# EAGLE design RGB-strip-connector-v2 (EAGLE 7.2.0)
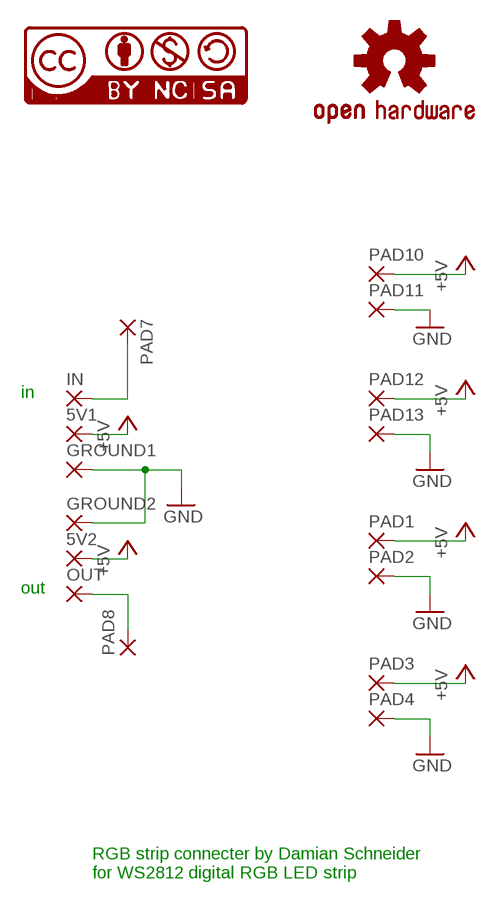
[diagram p0: schematic, sheet 1]

## Parts
5V1  SMD2  [SMD1,27-2,54]
5V2  SMD2  [SMD1,27-2,54]
GROUND1  SMD2  [SMD1,27-2,54]
GROUND2  SMD2  [SMD1,27-2,54]
IN  SMD2  [SMD1,27-2,54]
LOGO1  OSHW-LOGOL  [OSHW-LOGO-L]
OUT  SMD2  [SMD1,27-2,54]
PAD1  SMD5  [SMD2,54-5,08]
PAD2  SMD5  [SMD2,54-5,08]
PAD3  SMD5  [SMD2,54-5,08]
PAD4  SMD5  [SMD2,54-5,08]
PAD7  SMD2  [SMD1,27-2,54]
PAD8  SMD2  [SMD1,27-2,54]
PAD10  SMD5  [SMD2,54-5,08]
PAD11  SMD5  [SMD2,54-5,08]
PAD12  SMD5  [SMD2,54-5,08]
PAD13  SMD5  [SMD2,54-5,08]
U$1  CC-NC-BCNIX  [CC-NC-B_NIX]

## Nets
+5V: 5V1.1(P) 5V2.1(P) PAD1.1(P) PAD3.1(P) PAD10.1(P) PAD12.1(P)
GND: GROUND1.1(P) GROUND2.1(P) PAD2.1(P) PAD4.1(P) PAD11.1(P) PAD13.1(P)
N$1: OUT.1(P) PAD8.1(P)
N$2: IN.1(P) PAD7.1(P)

## Notes on the sheet
- in
- out
- RGB strip connecter by Damian Schneider
  for WS2812 digital RGB LED strip

## Library data of the parts
5V1 5V2 GROUND1 GROUND2 IN OUT PAD7 PAD8 = wirepad:SMD2: SMD PAD
LOGO1 = SparkFun-Aesthetics:OSHW-LOGO: Open Source Hardware Logo This logo indicates the piece of hardware it is found on incorporates a OSHW license and/or adheres to the definition of open source hardware found here: http://freedomdefined.org/OSHW
PAD1-PAD4 PAD10-PAD13 = wirepad:SMD5: SMD PAD
U$1 = cc-by-nc-sa:CC-NC-BC: All hardware is licensed under the Creative Commons Attribution-Noncommercial-Share Alike 2.5 Switzerland License. To view a copy of this license, visit http://creativecommons.org/licenses/by-nc-sa/2.5/ch/ or send a letter to Creative Commons, 171 Second Street, Suite 300, San Francisco, California, 94105, USA.

## Board
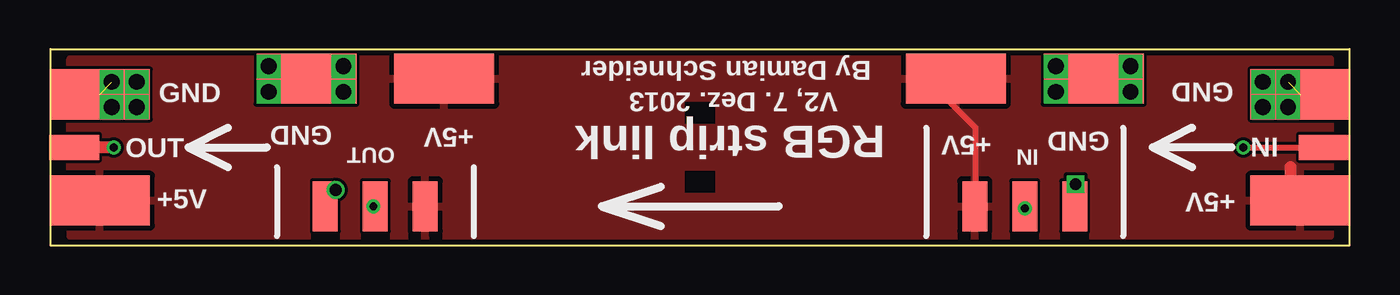
[diagram p1: board, top side]
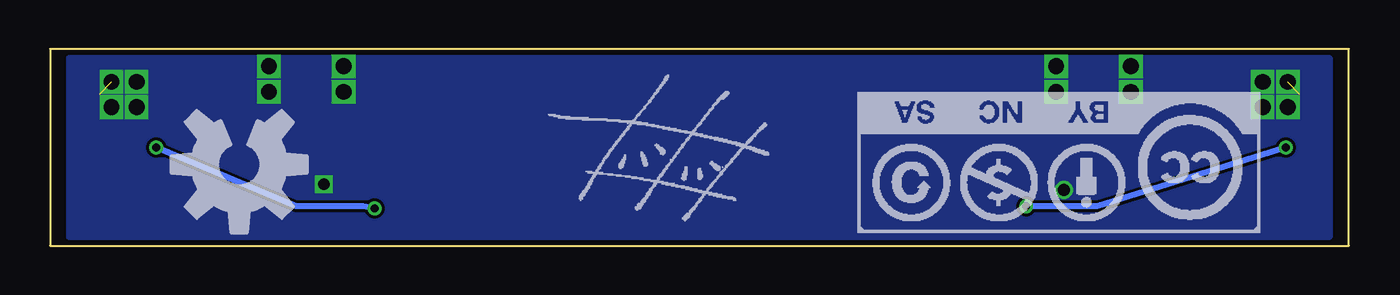
[diagram p2: board, bottom side, seen from below]

Size 66 x 10 mm. Coordinates in mm from the lower left corner, seen from the top.
Outline: 0,10 66,10 66,0 0,0 0,10
Copper layers (1*16): Top 0.035mm / dielectric 1.5mm / Bottom 0.035mm
Design rules "Fusion_eagle_rule_v1.1": minimum track width 6mil, minimum drill 12mil, track to track 6mil, track to pad 6mil, pad to pad 6mil, via to via 6mil, smd to smd 0mil, copper to edge 10mil, drill to drill 10mil, minimum pad ring 10mil, minimum via ring 6mil, stop-mask expansion 2mil, vias tented up to drill 100mil, thermal gap 10mil

### Footprints (pad centres in the part's own frame; a part is rotated, then mirrored left to right if it is on the bottom)
SMD1,27-2,54 = smd 1.27 x 2.54: 1 0,0
SMD2,54-5,08 = smd 2.54 x 5.08: 1 0,0

### Placement (x,y rotation side)
5V1  46.96,2 0 top
5V2  19.04,2 0 top
GROUND1  52.04,2 0 top
GROUND2  13.96,2 0 top
IN  49.5,2 180 top
LOGO1  56.38,4.14 180 bottom
OUT  16.5,2 0 top
PAD1  20,8.5 90 top
PAD2  13,8.5 90 top
PAD3  46,8.5 90 top
PAD4  53,8.5 90 top
PAD7  64.7,5 90 top
PAD8  1.2,5 90 top
PAD10  2.5,2.3 90 top
PAD11  2.5,7.7 90 top
PAD12  63.5,2.3 90 top
PAD13  63.5,7.7 90 top
U$1  0.29,10.87 0 top

### Tracks (layer width: path | path; a pad name or v marks a point on that pad's centre or on a via)
+5V
  Top 0.305: 44.5,8.5 47,6 47,2.04 5V1.1 | 63,3.5 63,2.8 PAD12.1
  Top 0.406: PAD10.1 3,1.6 | 64.6,2.3 PAD12.1
  Top 0.6: 63,4 63,3.5
  pour Top: 32,9.5 32,0.5 1,0.5 1,9.5
  pour Top: 34,9.5 65,9.5 65,0.5 34,0.5
  pour Top: 31,9.5 35,9.5 35,7.5 31,7.5
  pour Top: 31,6 35,6 35,4 31,4
  pour Top: 31,2.5 35,2.5 35,0.5 31,0.5
GND  (via drill 0.6, 0.8)  (2 unrouted)
  Top 0.305: v14.88,7.83 13.67,7.83 PAD2.1 | v54.88,7.83 53.67,7.83 PAD4.1
  Top 0.406: v14.48,2.83 13.8,2.53 13.8,2 GROUND2.1 | v52.08,3.13 52.04,3.13 GROUND1.1
  other vias: 4.38,8.33 4.38,7.05 3.1,8.33 3.1,7.05 11.08,9.13 11.08,7.83 14.88,9.13 62.88,8.33 62.88,7.05 61.6,8.33 61.6,7.05 54.88,9.13 51.08,7.83 51.08,9.13
  pour Bottom: 1,9.5 65,9.5 65,0.5 1,0.5
N$1  (via drill 0.4)
  Top 0.305: v16.4,2 OUT.1
  Top 0.61: v3.2,5 PAD8.1
  Bottom 0.305: v3.2,5 12.8,2 v16.4,2
N$2  (via drill 0.4)
  Top 0.305: IN.1 v49.5,1.9 | v60.6,5 PAD7.1
  Bottom 0.305: v49.5,1.9 50.1,2 53.5,2 v60.6,5

### Text on the board
tNames: By Damian Schneider | V2, 7. Dez. 2013 | GND | GND | GND | +5V | RGB strip link | +5V | GND | IN | OUT | IN | OUT | +5V | +5V